# EAGLE design source_eagle (EAGLE 9.6.2)
COMPANY: ADAFRUIT INDUSTRIES; DRAWN: KTOWN; REV: A
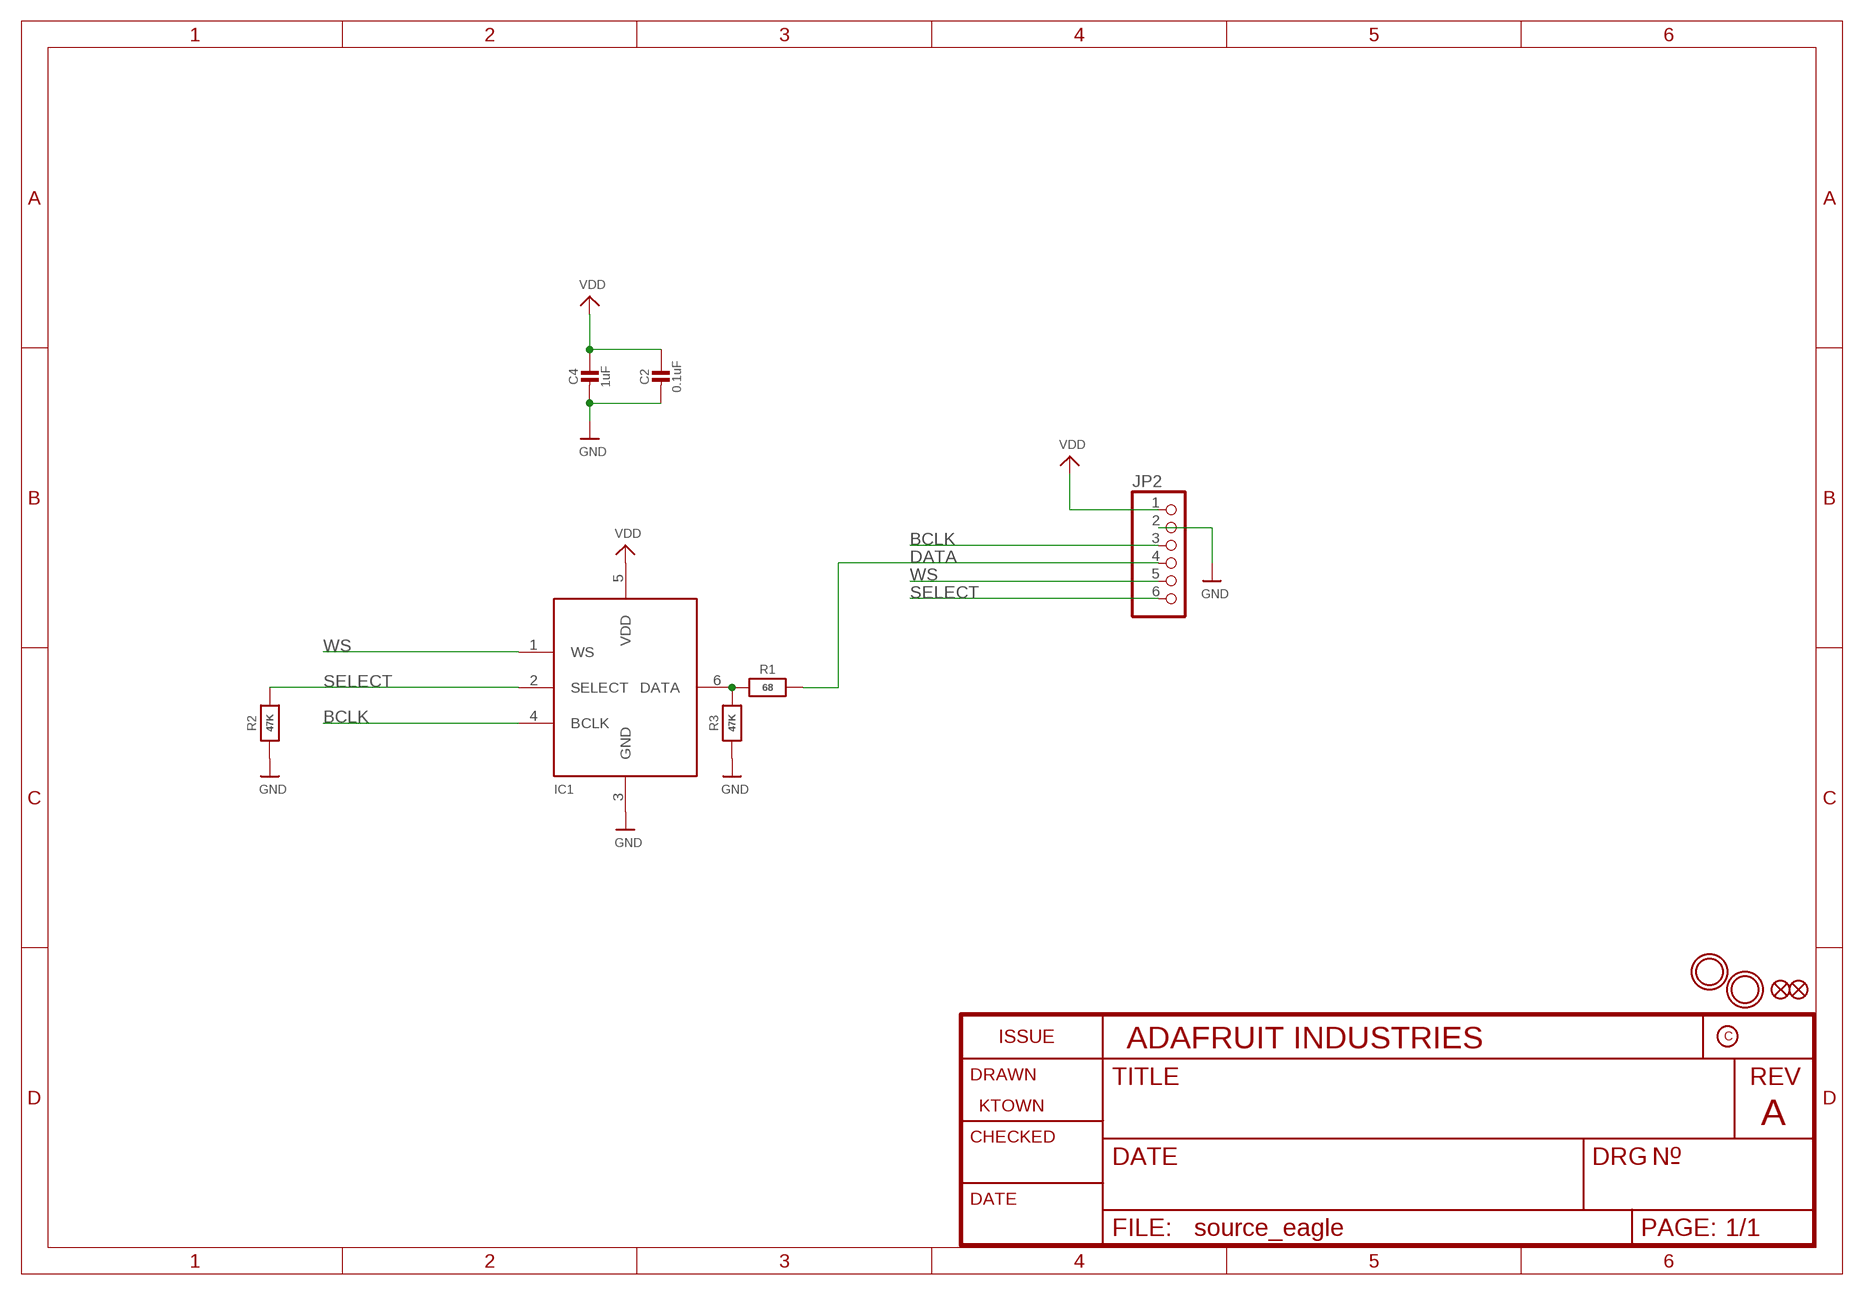
[diagram p0: schematic, sheet 1]

## Parts
C2  0.1uF  CAP_CERAMIC0603_NO  [0603-NO]
C4  1uF  CAP_CERAMIC0603_NO  [0603-NO]
FID1  FIDUCIAL_0.5MM  [FIDUCIAL_0.5MM]
FID2  FIDUCIAL_0.5MM  [FIDUCIAL_0.5MM]
IC1  ICS-43434  MIC_I2S_SPH0645  [SPH0645LM4H]
JP2  HEADER-1X6ROUND  [1X06_ROUND]
R1  68  RESISTOR_0603_NOOUT  [0603-NO]
R2  47K  RESISTOR_0603_NOOUT  [0603-NO]
R3  47K  RESISTOR_0603_NOOUT  [0603-NO]
U$6  MOUNTINGHOLE2.5  [MOUNTINGHOLE_2.5_PLATED]
U$12  MOUNTINGHOLE2.5  [MOUNTINGHOLE_2.5_PLATED]

## Nets
BCLK: IC1.4(BCLK) JP2.3
DATA: JP2.4 R1.2
GND: C2.2 C4.2 IC1.3(GND) JP2.2 R2.1 R3.1
N$1: IC1.6(DATA) R1.1 R3.2
SELECT: IC1.2(SELECT) JP2.6 R2.2
VDD: C2.1 C4.1 IC1.5(VDD) JP2.1
WS: IC1.1(WS) JP2.5

## Library data of the parts
C2 C4 = microbuilder:CAP_CERAMIC: Ceramic Capacitors For new designs, use the packages preceded by an '_' character since they are more reliable: The following footprints should be used on most boards: _0402 - Standard footprint for regular board layouts _0603 - Standard footprint for regular board layouts _0805 - Standard footprint for regular board layouts _1206 - Standard footprint for regular board layouts For extremely tight-pitch boards where space is at a premium, the following 'micro-pitch' footprints can be used (smaller pads, no silkscreen outline, etc.): _0402MP - Micro-pitch footprint for very dense/compact boards _0603MP - Micro-pitch footprint for very dense/compact boards _0805MP - Micro-pitch footprint for very dense/compact boards _1206MP - Micro-pitch footprint for very dense/compact boards
FID1 FID2 = microbuilder:FIDUCIAL: Fiducial Alignment Points Various fiducial points for machine vision alignment.
IC1 = microbuilder:MIC_I2S
JP2 = microbuilder:HEADER-1X6: PIN HEADER
R1-R3 = microbuilder:RESISTOR: Resistors For new designs, use the packages preceded by an '_' character since they are more reliable: The following footprints should be used on most boards: _0402 - Standard footprint for regular board layouts _0603 - Standard footprint for regular board layouts _0805 - Standard footprint for regular board layouts _1206 - Standard footprint for regular board layouts For extremely tight-pitch boards where space is at a premium, the following 'micro-pitch' footprints can be used (smaller pads, no silkscreen outline, etc.): _0402MP - Micro-pitch footprint for very dense/compact boards _0603MP - Micro-pitch footprint for very dense/compact boards _0805MP - Micro-pitch footprint for very dense/compact boards _1206MP - Micro-pitch footprint for very dense/compact boards
U$6 U$12 = adafruit_electromech:MOUNTINGHOLE: Mounting Hole For #2 screws (0.086"/2.18mm width, 0.094"/2.4mm hole) use 2.5mm; BOM: EXCLUDE

## Board
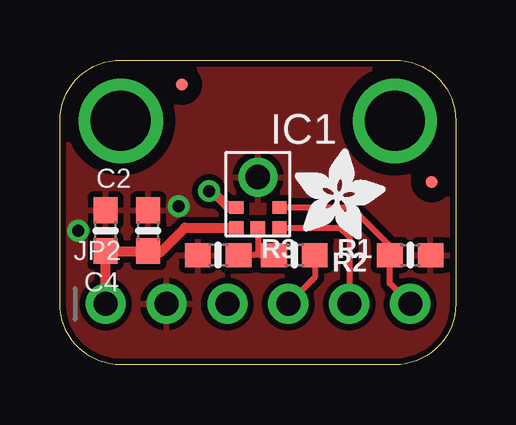
[diagram p1: board, top side]
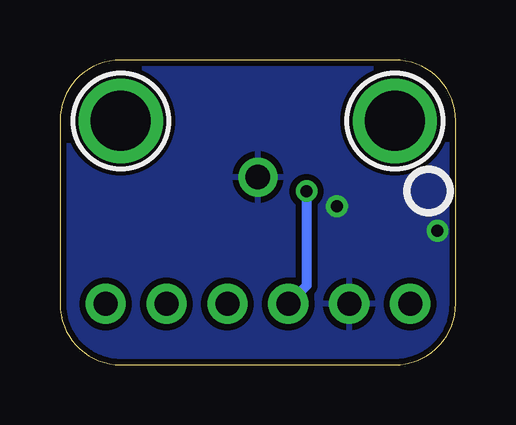
[diagram p2: board, bottom side, seen from below]

Size 16.51 x 12.7 mm. Coordinates in mm from the lower left corner, seen from the top.
Outline: 16.51,10.16 16.51,2.54 arc-90 13.97,0 2.54,0 arc-90 0,2.54 0,10.16 arc-90 2.54,12.7 13.97,12.7 arc-90 16.51,10.16
Copper layers (1*16): Top 0.035mm / dielectric 1.5mm / Bottom 0.035mm
Design rules "adafruit 8-8": minimum track width 6mil, minimum drill 15.5mil, track to track 8mil, track to pad 8mil, pad to pad 8mil, via to via 8mil, smd to smd 8mil, copper to edge 10mil, drill to drill 8mil, minimum pad ring 10mil, minimum via ring 8mil, stop-mask expansion 2mil, vias tented up to drill 20mil, thermal gap 10mil

### Footprints (pad centres in the part's own frame; a part is rotated, then mirrored left to right if it is on the bottom)
0603-NO = smd 1.075 x 1: 1 -0.85,0; 2 0.85,0
FIDUCIAL_0.5MM = smd 0.5 x 0.5: 1 0,0
SPH0645LM4H = smd 0.6 x 0.525: 1 -0.9,1.4; 2 -0.9,0.55; 4 0.9,0.55; 5 0.9,1.4; 6 0,1.4 | drill 1.025 pad 1.625: 3 0,-0.71
1X06_ROUND = drill 1 pad 1.676: 1 -6.35,0; 2 -3.81,0; 3 -1.27,0; 4 1.27,0; 5 3.81,0; 6 6.35,0
MOUNTINGHOLE_2.5_PLATED = drill 2.5 pad 3.2: P$1 0,0

### Placement (x,y rotation side)
C2  3.68,5.59 90 top
C4  1.91,5.59 90 top
FID1  5.08,11.68 0 top
FID2  15.49,7.62 0 top
IC1  8.26,7.11 180 top
JP2  8.26,2.54 0 top
PLABEL0  [PLABEL0]  8.26,1.02 0 top
PLABEL1  [PLABEL1]  4.45,5.21 90 bottom
PLABEL2  [PLABEL2]  6.99,5.21 90 bottom
PLABEL3  [PLABEL3]  9.65,5.59 90 bottom
PLABEL4  [PLABEL4]  14.61,4.7 90 bottom
PLABEL5  [PLABEL5]  1.91,4.45 90 bottom
PLABEL7  [PLABEL7]  12.06,5.21 90 bottom
PLABEL8  [PLABEL8]  7.24,7.49 0 bottom
PLABEL9  [PLABEL9]  8.26,10.67 0 top
PLABEL10  [PLABEL10]  8.26,10.67 0 bottom
R1  9.78,4.57 0 top
R2  14.61,4.57 180 top
R3  6.6,4.57 0 top
U$5  [ADAFRUIT_3.5MM]  9.78,5.21 0 top
U$6  13.97,10.16 0 bottom
U$12  2.54,10.16 0 bottom
U$13  [PCBFEAT-REV-040]  1.14,7.24 0 bottom

### Tracks (layer width: path | path; a pad name or v marks a point on that pad's centre or on a via)
BCLK  (via drill 0.5)
  Top 0.406: IC1.4 7.03,6.56 6.35,7.24 v6.22,7.24
  Bottom 0.406: v6.22,7.24 6.22,3.3 JP2.3
DATA
  Top 0.254: JP2.4 10.63,3.64 R1.2
GND  (via drill 0.5)
  other vias: 0.76,5.59 4.95,6.6
  pour Top (isolate 0.254): 16.51,0 0,0 0,12.7 16.51,12.7
  pour Bottom (isolate 0.254): 16.51,0 0,0 0,12.7 16.51,12.7
N$1
  Top 0.254: IC1.6 8.26,4.7 | 8.26,4.7 8.26,4.63 8.31,4.57 R1.1 | 8.26,4.7 8.13,4.57 R3.2
SELECT
  Top 0.254: IC1.2 12.15,6.56 13.76,4.95 R2.2 13.76,3.39 JP2.6
VDD
  Top 0.406: JP2.1 C4.1 C2.1 4.18,4.68 5.21,5.71 IC1.5
WS
  Top 0.254: IC1.1 11.69,5.71 12.06,5.33 JP2.5

### Text on the board
Pinguin_tBackup: ICS / 43434 | VIN/Logic: 3.3V
Pinguin_bBackup: ICS43434 / I2S Mic | Port | 3V | GND | BCLK | DOUT | LRCL | SEL